# EAGLE design rb1.2 panelized (EAGLE 9.5.2)
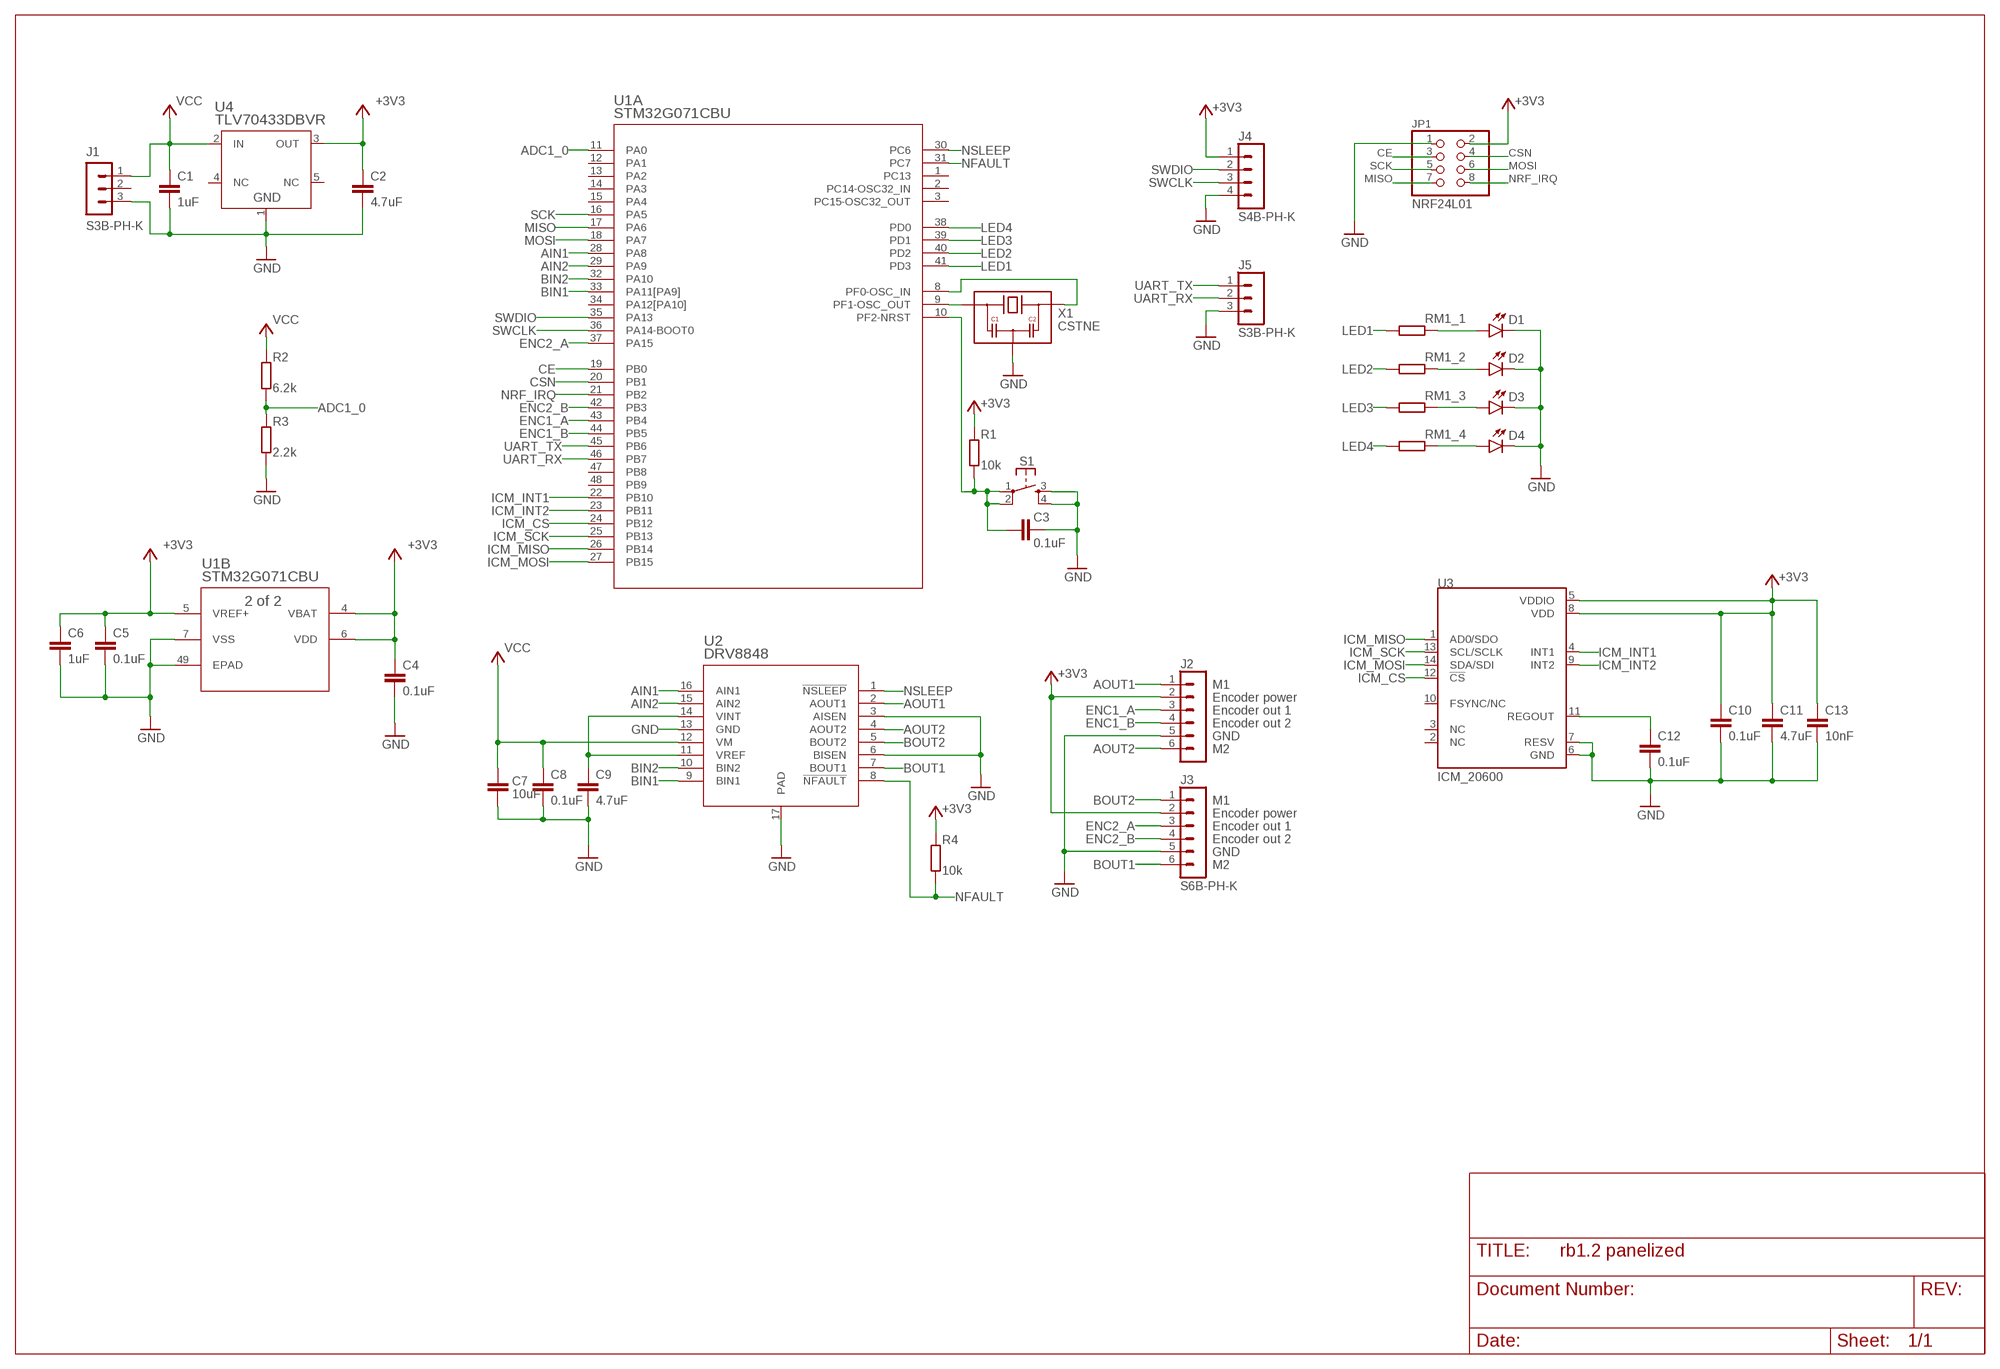
[diagram p0: schematic, sheet 1]

## Parts
C1  1uF  C-EU-K0603  [C0603K]
C2  4.7uF  C-EU-K0603  [C0603K]
C3  0.1uF  C-EU-K0402  [C0402K]
C4  0.1uF  C-EU-K0603  [C0603K]
C5  0.1uF  C-EU-K0603  [C0603K]
C6  1uF  C-EU-K0603  [C0603K]
C7  10uF  C-EU-K1206  [C1206K]
C8  0.1uF  C-EU-K0603  [C0603K]
C9  4.7uF  C-EU-K0603  [C0603K]
C10  0.1uF  C-EU-K0603  [C0603K]
C11  4.7uF  C-EU-K0603  [C0603K]
C12  0.1uF  C-EU-K0603  [C0603K]
C13  10nF  C-EU-K0603  [C0603K]
D1  LED0805  [LED-0805]
D2  LED0805  [LED-0805]
D3  LED0805  [LED-0805]
D4  LED0805  [LED-0805]
J1  S3B-PH-K  [S3B-PH-K]
J2  S6B-PH-K  [S6B-PH-K]
J3  S6B-PH-K  [S6B-PH-K]
J4  S4B-PH-K  [S4B-PH-K]
J5  S3B-PH-K  [S3B-PH-K]
JP1  NRF24L01  PINHD-2X4  [2X04]
R1  10k  R-EU0603  [R0603]
R2  6.2k  R-EU0603  [R0603]
R3  2.2k  R-EU0603  [R0603]
R4  10k  R-EU0603  [R0603]
RM1  RES_ARRAY  [0603-ARC]
S1  MOMENTARY-SWITCH-SPST-2-[SMD-5.2MM]  [TACTILE_SWITCH_SMD_5.2MM]
U1  STM32G071CBU  STM32G0_UFQFPN48  [UFQFPN48-7X7MM]
U2  DRV8848  DRV8848[NORMAL_PADS]  [HTSSOP]
U3  ICM_20600  [14_PIN_LGA]
U4  TLV70433DBVR  TLV70433DBVR[NORMAL_PADS]  [SOT-23-5]
X1  CSTNE  [MURATA_SMD_3P]

## Nets
+3V3: C2.1 C4.1 C5.1 C6.1 C10.1 C11.1 C13.1 J2.2 J3.2 J4.1 JP1.2 R1.2 R4.2 U1.4(B:VBAT) U1.5(B:VREF+) U1.6(B:VDD) U3.5(VDDIO) U3.8(VDD) U4.3(OUT)
ADC1_0: R2.1 R3.2 U1.11(A:PA0)
AIN1: U1.28(A:PA8) U2.16(AIN1)
AIN2: U1.29(A:PA9) U2.15(AIN2)
AOUT1: J2.1 U2.2(AOUT1)
AOUT2: J2.6 U2.4(AOUT2)
BIN1: U1.33(A:PA11[PA9]) U2.9(BIN1)
BIN2: U1.32(A:PA10) U2.10(BIN2)
BOUT1: J3.6 U2.7(BOUT1)
BOUT2: J3.1 U2.5(BOUT2)
CE [NRF24L01]: JP1.3 U1.19(A:PB0)
CSN [NRF24L01]: JP1.4 U1.20(A:PB1)
ENC1_A: J2.3 U1.43(A:PB4)
ENC1_B: J2.4 U1.44(A:PB5)
ENC2_A: J3.3 U1.37(A:PA15)
ENC2_B: J3.4 U1.42(A:PB3)
GND: C1.2 C2.2 C3.1 C4.2 C5.2 C6.2 C7.2 C8.2 C9.2 C10.2 C11.2 C12.2 C13.2 D1.-(C) D2.-(C) D3.-(C) D4.-(C) J1.3 J2.5 J3.5 J4.4 J5.3 JP1.1 R3.1 S1.3 S1.4 U1.7(B:VSS) U1.49(B:EPAD) U2.3(AISEN) U2.6(BISEN) U2.13(GND) U2.17(PAD) U3.6(GND) U3.7(RESV) U4.1(GND) X1.2(GND)
ICM_CS [ICM20600]: U1.24(A:PB12) U3.12(!CS)
ICM_INT1 [ICM20600]: U1.22(A:PB10) U3.4(INT1)
ICM_INT2 [ICM20600]: U1.23(A:PB11) U3.9(INT2)
ICM_MISO [ICM20600]: U1.26(A:PB14) U3.1(AD0/SDO)
ICM_MOSI [ICM20600]: U1.27(A:PB15) U3.14(SDA/SDI)
ICM_SCK [ICM20600]: U1.25(A:PB13) U3.13(SCL/SCLK)
LED1: RM1.1 U1.41(A:PD3)
LED2: RM1.2 U1.40(A:PD2)
LED3: RM1.3 U1.39(A:PD1)
LED4: RM1.4 U1.38(A:PD0)
MISO [NRF24L01]: JP1.7 U1.17(A:PA6)
MOSI [NRF24L01]: JP1.6 U1.18(A:PA7)
N$2: U1.8(A:PF0-OSC_IN) X1.3(OUT)
N$3: U1.9(A:PF1-OSC_OUT) X1.1(IN)
N$4: D4.+(A) RM1.5
N$6: D3.+(A) RM1.6
N$7: D2.+(A) RM1.7
N$8: D1.+(A) RM1.8
NFAULT: R4.1 U1.31(A:PC7) U2.8(!NFAULT)
NRF_IRQ [NRF24L01]: JP1.8 U1.21(A:PB2)
NSLEEP: U1.30(A:PC6) U2.1(!NSLEEP)
REG: C12.1 U3.11(REGOUT)
RESET: C3.2 R1.1 S1.1 S1.2 U1.10(A:PF2-NRST)
SCK [NRF24L01]: JP1.5 U1.16(A:PA5)
SWCLK: J4.3 U1.36(A:PA14-BOOT0)
SWDIO: J4.2 U1.35(A:PA13)
UART_RX: J5.2 U1.46(A:PB7)
UART_TX: J5.1 U1.45(A:PB6)
VCC: C1.1 C7.1 C8.1 J1.1 R2.2 U2.12(VM) U4.2(IN)
VREF: C9.1 U2.11(VREF) U2.14(VINT)
Unconnected: J1.2 U1.1(A:PC13) U1.2(A:PC14-OSC32_IN) U1.3(A:PC15-OSC32_OUT) U1.12(A:PA1) U1.13(A:PA2) U1.14(A:PA3) U1.15(A:PA4) U1.34(A:PA12[PA10]) U1.47(A:PB8) U1.48(A:PB9) U3.2(NC) U3.3(NC) U3.10(FSYNC/NC) U4.4(NC) U4.5(NC)

## Notes on the sheet
- M1
- Encoder power
- Encoder out 1
- Encoder out 2
- GND
- M2
- M1
- Encoder power
- Encoder out 1
- Encoder out 2
- GND
- M2

## Library data of the parts
C1-C13 = Capacitors:C-EU-K
D1-D4 = Semiconductor_devices:LED0805: LED Model suitable for all 0805 leds Updated: 22.10.19 by Andrey Dovnar, andrevdovnar@gmail.com
J1 J5 = con-jst-ph:S3B-PH-K: Wire to board connector Model suitable for S3B-PH-K Updated: 21.10.19 by Andrey Dovnar, andrevdovnar@gmail.com
J2 J3 = con-jst-ph:S6B-PH-K: Wire to board connector Model suitable for S6B-PH-K Updated: 21.10.19 by Andrey Dovnar, andrevdovnar@gmail.com
J4 = con-jst-ph:S4B-PH-K: Wire to board connector Model suitable for S4B-PH-K Updated: 21.10.19 by Andrey Dovnar, andrevdovnar@gmail.com
JP1 = pinhead:PINHD-2X4: PIN HEADER
R1-R4 = Resistors:R-EU
RM1 = Resistors:RES_ARRAY
S1 = buttons and switches:MOMENTARY-SWITCH-SPST-2: Smd buttom Updated: 16.11.19 by Andrey Dovnar, andrevdovnar@gmail.com; PROD_ID: SWCH-08247; SF_SKU: COM-08720
U1 = stmicroelectronics:STM32G0_UFQFPN48: MCU Model suitable for STM32G071CBU3/6 Created: 16.11.19 by Andrey Dovnar, andrevdovnar@gmail.com
U2 = texas Instrumets:DRV8848: Integrated motor driver Model suitable for DRV8848PWP 2 канала по 1 А. Максимальное входное напряжение - 18 В. Поддерживает параллельное включение каналов. Created: 18.10.19 by Andrey Dovnar, andrevdovnar@gmail.com
U3 = InvenSence:ICM_20600: 6-axis IMU Model suitable for ICM-20600 Created: 18.10.19 by Andrey Dovnar, andrevdovnar@gmail.com Updated: 16.11.19 by Andrey Dovnar, andrevdovnar@gmail.com
U4 = texas Instrumets:TLV70433DBVR: LDO Model suitable for TLV70433DBVR Created: 18.10.19 by Andrey Dovnar, andrevdovnar@gmail.com; TEST: da
X1 = resonators and oscillators:CSTNE: Ceramic Resonator with integrated load capacitors No external components required Model suitable for all Murata electronics resonators from CSTNE_G, CSTNE_V, CSTNE_VH3L and CSTNE_GH5L families Created: 16.11.19 by Andrey Dovnar, andrevdovnar@gmail.com

## Board
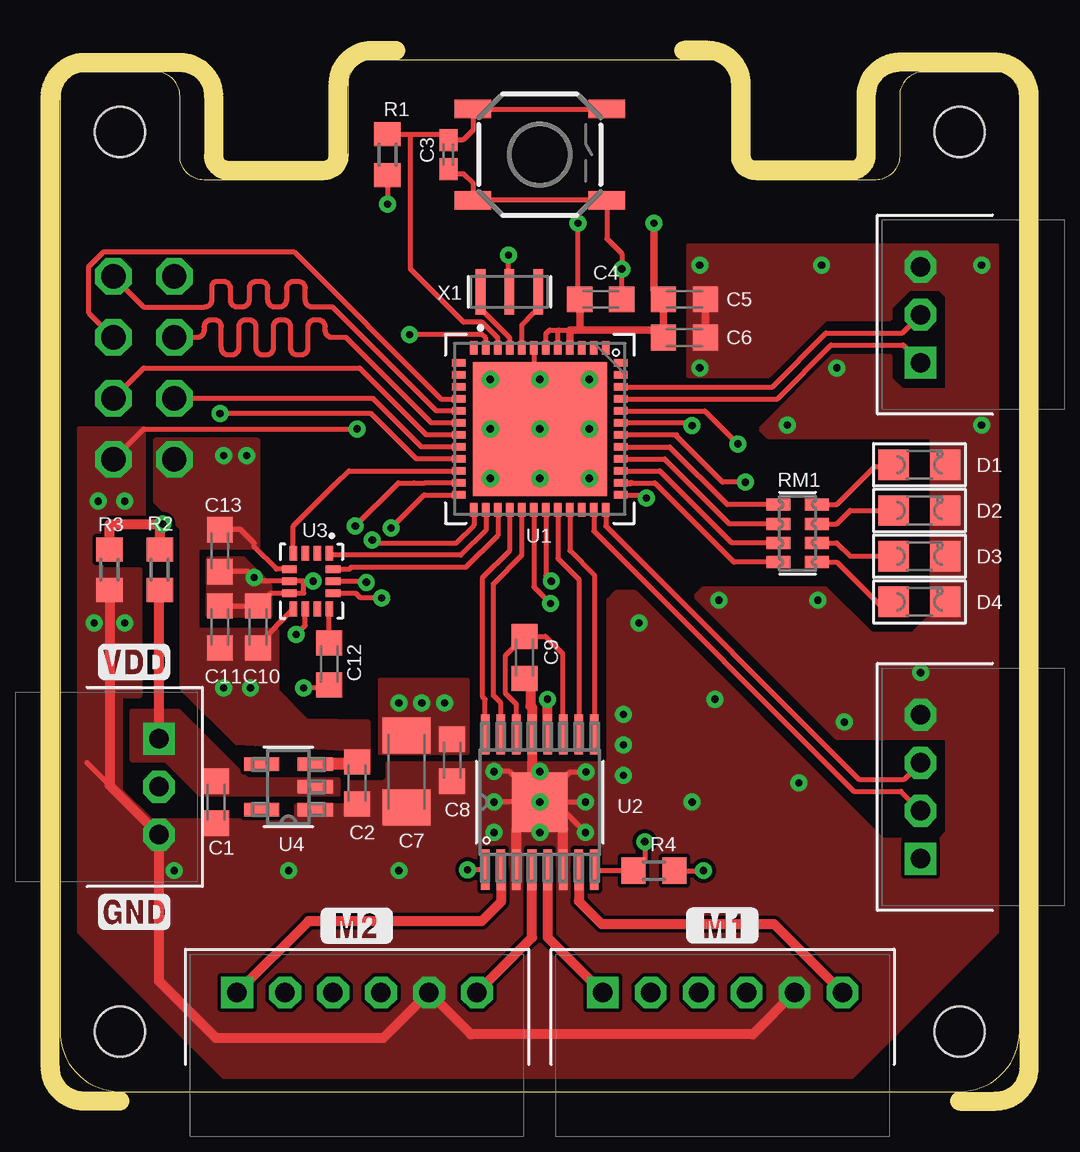
[diagram p1: board, top side]
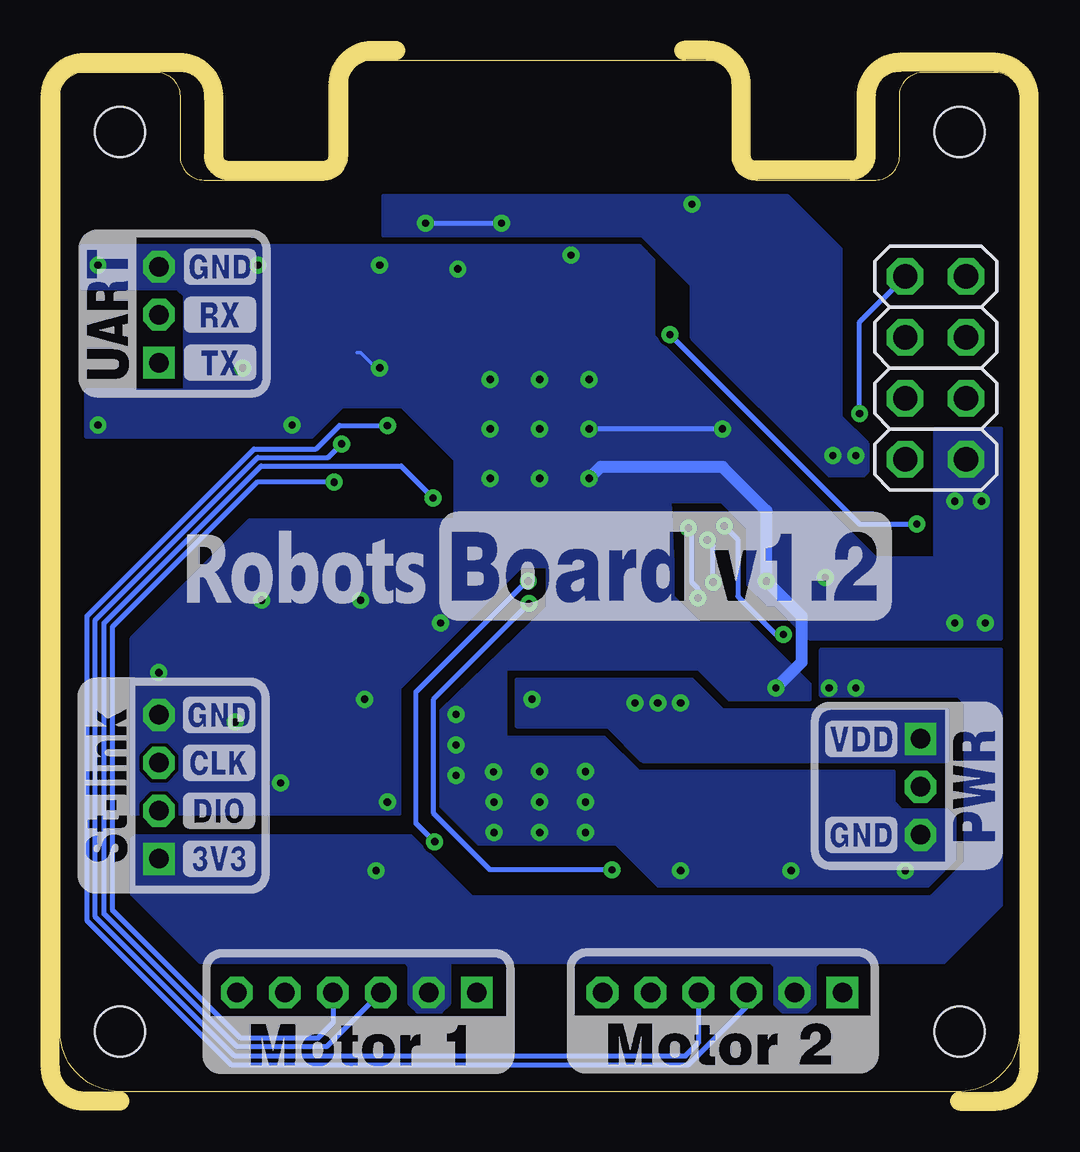
[diagram p2: board, bottom side, seen from below]

Size 40 x 43 mm. Coordinates in mm from the lower left corner, seen from the top.
Outline: 11,38 6,38 arc-90 5,39 5,41.5 arc90 4,42.5 1,42.5 arc90 0,41.4 0,2.5 arc90 2.5,0 37.5,0 arc90 40,2.5 40,41.5 arc90 39,42.5 36,42.5 arc90 35,41.5 35,39 arc-90 34,38 29,38 arc-90 28,39 28,42 arc90 27,43 13,43 arc90 12,42 12,39 arc-90 11,38
Copper layers (1*16): Top 0.035mm / dielectric 1.5mm / Bottom 0.035mm
Design rules "default *": minimum track width 6mil, minimum drill 0.3mm, track to track 6mil, track to pad 6mil, pad to pad 6mil, via to via 6mil, smd to smd 6mil, copper to edge 10mil, drill to drill 6mil, minimum pad ring 10mil, minimum via ring 8mil, stop-mask expansion 4mil, vias tented up to drill 20mil, thermal gap 10mil
Holes 2.1 mm at 37.5,40 2.5,40 2.5,2.5 37.5,2.5
Milling: 26 lines

### Footprints (pad centres in the part's own frame; a part is rotated, then mirrored left to right if it is on the bottom)
C0603K = smd 1.05 x 1.08: 1 -0.875,0; 2 0.875,0
C0402K = smd 0.925 x 0.74: 1 -0.6,0; 2 0.6,0
C1206K = smd 1.5 x 2: 1 -1.5,0; 2 1.5,0
LED-0805 = smd 1.27 x 1.27: + -1.079,0; - 1.079,0
S3B-PH-K = drill 0.813 square: 1 -2,0 | drill 0.813 octagon: 2 0,0; 3 2,0
S6B-PH-K = drill 0.813 square: 1 -5,0 | drill 0.813 octagon: 2 -3,0; 3 -1,0; 4 1,0; 5 3,0; 6 5,0
S4B-PH-K = drill 0.813 square: 1 -3,0 | drill 0.813 octagon: 2 -1,0; 3 1,0; 4 3,0
2X04 = drill 1.016 octagon: 1 -3.81,-1.27; 2 -3.81,1.27; 3 -1.27,-1.27; 4 -1.27,1.27; 5 1.27,-1.27; 6 1.27,1.27; 7 3.81,-1.27; 8 3.81,1.27
R0603 = smd 1 x 1.1: 1 -0.85,0; 2 0.85,0
0603-ARC = smd 0.5 x 1: 1 -1.2,-0.802; 2 -0.4,-0.802; 3 0.4,-0.802; 4 1.2,-0.802; 5 1.2,0.802; 6 0.4,0.802; 7 -0.4,0.802; 8 -1.2,0.802
TACTILE_SWITCH_SMD_5.2MM = smd 1.524 x 0.762: 1 -2.794,1.905; 2 2.794,1.905; 3 -2.794,-1.905; 4 2.794,-1.905
UFQFPN48-7X7MM = smd 0.559 x 0.305: 1 -3.375,2.751; 2 -3.375,2.251; 3 -3.375,1.75; 4 -3.375,1.25; 5 -3.375,0.75; 6 -3.375,0.25; 7 -3.375,-0.25; 8 -3.375,-0.75; 9 -3.375,-1.25; 10 -3.375,-1.75; 11 -3.375,-2.251; 12 -3.375,-2.751; 25 3.375,-2.751; 26 3.375,-2.251; 27 3.375,-1.75; 28 3.375,-1.25; 29 3.375,-0.75; 30 3.375,-0.25; 31 3.375,0.25; 32 3.375,0.75; 33 3.375,1.25; 34 3.375,1.75; 35 3.375,2.251; 36 3.375,2.751 | smd 0.305 x 0.559: 13 -2.751,-3.375; 14 -2.251,-3.375; 15 -1.75,-3.375; 16 -1.25,-3.375; 17 -0.75,-3.375; 18 -0.25,-3.375; 19 0.25,-3.375; 20 0.75,-3.375; 21 1.25,-3.375; 22 1.75,-3.375; 23 2.251,-3.375; 24 2.751,-3.375; 37 2.751,3.375; 38 2.251,3.375; 39 1.75,3.375; 40 1.25,3.375; 41 0.75,3.375; 42 0.25,3.375; 43 -0.25,3.375; 44 -0.75,3.375; 45 -1.25,3.375; 46 -1.75,3.375; 47 -2.251,3.375; 48 -2.751,3.375 | smd 5.588 x 5.588: 49 0,0
HTSSOP = smd 1.676 x 0.356: 1 -2.819,2.275; 2 -2.819,1.625; 3 -2.819,0.975; 4 -2.819,0.325; 5 -2.819,-0.325; 6 -2.819,-0.975; 7 -2.819,-1.625; 8 -2.819,-2.275; 9 2.819,-2.275; 10 2.819,-1.625; 11 2.819,-0.975; 12 2.819,-0.325; 13 2.819,0.325; 14 2.819,0.975; 15 2.819,1.625; 16 2.819,2.275 | smd 2.464 x 2.311: 17 0,0
14_PIN_LGA = smd 0.61 x 0.3: 1 -1.16,0.75; 2 -1.16,0.25; 3 -1.16,-0.25; 4 -1.16,-0.75; 8 1.16,-0.75; 9 1.16,-0.25; 10 1.16,0.25; 11 1.16,0.75 | smd 0.3 x 0.61: 5 -0.5,-0.91; 6 0,-0.91; 7 0.5,-0.91; 12 0.5,0.91; 13 0,0.91; 14 -0.5,0.91
SOT-23-5 = smd 1.473 x 0.559: 1 -1.118,0.95; 2 -1.118,0; 3 -1.118,-0.95; 4 1.118,-0.95; 5 1.118,0.95
MURATA_SMD_3P = smd 0.4 x 1.9: 1 -1.2,0; 2 0,0; 3 1.2,0

### Placement (x,y rotation side)
C1  6.51,12.06 270 top
C2  12.38,12.86 270 top
C3  16.19,39.05 90 top
C4  22.54,33.02 0 top
C5  26.04,33.02 0 top
C6  26.04,31.43 0 top
C7  14.45,13.34 270 top
C8  16.35,13.81 270 top
C9  19.37,18.1 270 top
C10  8.26,19.37 90 top
C11  6.67,19.37 90 top
C12  11.23,17.82 270 top
C13  6.67,22.54 270 top
D1  35.83,26.12 0 top
D2  35.83,24.22 0 top
D3  35.83,22.31 0 top
D4  35.83,20.41 0 top
J1  4.13,12.7 270 top
J2  12.38,4.13 0 top
J3  27.62,4.13 0 top
J4  35.88,12.7 90 top
J5  35.88,32.38 90 top
JP1  3.49,30.16 90 bottom
R1  13.65,39.05 270 top
R2  4.16,21.75 270 top
R3  2.06,21.75 90 top
R4  24.77,9.21 0 top
RM1  30.75,23.27 270 top
S1  20,39.05 0 top
U1  20,27.62 270 top
U2  20,12.06 90 top
U3  10.48,21.27 270 top
U4  9.53,12.7 180 top
X1  18.73,33.34 0 top

### Tracks (layer width: path | path; a pad name or v marks a point on that pad's centre or on a via)
+3V3  (via drill 0.3, 0.3 pad 0.3)
  Top 0.203: U3.8 8.26,18.64 C10.1 | U3.5 9.03,21.77 8.1,22.7 8.1,22.86 7.54,23.42 C13.1 | C4.1 21.59,33.1 v21.59,36.2 | R1.2 v13.65,36.99 | R4.2 v26.83,9.21 | U1.5 20.75,31.71 20.8,31.75 | 20.8,31.75 21.27,31.75 | U1.6 20.25,31.59 20.41,31.75 20.8,31.75
  Top 0.305: 21.67,31.75 24.77,31.75 25.16,31.36 C6.1 C5.1 24.77,33.41 v24.77,36.2 | 21.67,31.75 21.27,31.75 21.25,31.73 U1.4 | C4.1 21.67,31.75
  Top 0.508: C2.1 12.3,13.65 U4.3
  Bottom 0.203: v24.77,36.2 v21.59,36.2
  other vias: 7.78,26.51 7.94,16.83 6.83,16.83 6.83,26.51
  pour Top (no thermals): 7.36,14.54 12.22,14.29 12.22,13.34 12.86,13.34 12.86,15.4 10.27,15.45 9.05,16.67 9.05,19.21 5.72,19.21 5.72,22.7 8.26,22.7 8.26,27.15 3.97,27.15 3.97,24.61 5.08,23.5 5.08,16.83
  pour Bottom (no thermals): 26.51,35.72 15.72,35.72 13.65,33.66 13.65,31.43 7.94,25.72 6.51,25.72 6.35,25.88 6.35,26.99 7.46,28.1 7.46,35.08 9.68,37.31 26.51,37.31
  pour Bottom (no thermals): 36.83,10.64 25.4,10.64 22.86,8.1 3.65,8.1 2.22,9.53 2.22,16.19 2.54,16.51 8.26,16.51 8.26,18.41 0.79,18.41 0.79,7.78 3.18,5.4 8.41,5.4 8.57,5.24 8.57,3.65 8.89,3.33 9.84,3.33 10.16,3.65 10.16,5.24 10.32,5.4 23.81,5.4 23.81,3.65 24.13,3.33 25.08,3.33 25.4,3.65 25.4,5.24 25.56,5.4 34.13,5.4 36.99,8.26 36.99,10.48
ADC1_0  (via drill 0.3)
  Top 0.203: U1.11 17.75,31.4 | 17.75,31.4 17.75,31.41 | 17.75,31.4 17.6,31.55 v14.57,31.55
  Top 0.406: R3.2 2.06,23.65 v4.29,23.65 4.16,23.53 R2.1
  Bottom 0.203: v14.57,31.55 6.67,23.65 v4.29,23.65
AIN1
  Top 0.2: 18.75,22.56 17.62,21.43 17.62,16.45 17.73,16.35 U2.16
  Top 0.203: 18.75,22.56 U1.28
AIN2
  Top 0.2: 19.25,22.36 18.06,21.16 18.06,16.51 18.38,16.2 U2.15
  Top 0.203: 19.25,22.36 U1.29
AOUT1
  Top 0.406: U2.2 18.38,7.9 17.58,7.1 10.36,7.1 J2.1
AOUT2
  Top 0.406: J2.6 19.68,6.42 U2.4
BIN1
  Top 0.2: 21.25,22.54 22.28,21.52 U2.9
  Top 0.203: U1.33 21.25,22.54
BIN2
  Top 0.2: 20.75,22.23 21.63,21.35 U2.10
  Top 0.203: U1.32 20.75,22.23
BOUT1
  Top 0.406: U2.7 21.63,7.94 22.58,6.99 29.77,6.99 J3.6
BOUT2
  Top 0.406: U2.5 20.33,6.42 J3.1
CE
  Top 0.203: U1.19 15.27,27.37 12.48,30.16 3.49,30.16 JP1.3
CSN
  Top 0.203: U1.20 15.07,26.87 13.05,28.89 9.68,28.89 JP1.4
ENC1_A  (via drill 0.3)
  Top 0.203: v26.35,27.77 26.25,27.87 23.65,27.87 | U1.43 23.65,27.87 | 23.65,27.87
  Bottom 0.203: J2.3 11.38,3.53 13.8,1.12 32.87,1.12 38.88,7.13 38.88,19.81 31.91,26.78 29.33,26.78 28.35,27.77 v26.35,27.77
ENC1_B  (via drill 0.3)
  Top 0.203: v28.26,27 26.88,28.37 U1.44
  Bottom 0.203: J2.4 13.38,2.04 13.95,1.47 32.7,1.47 32.74,1.51 32.76,1.51 38.53,7.28 38.53,19.66 31.76,26.43 28.83,26.43 v28.26,27
ENC2_A  (via drill 0.3)
  Top 0.203: v24.45,24.74 24.32,24.87 U1.37
  Bottom 0.203: v24.45,24.74 25.78,26.07 31.61,26.07 38.17,19.52 38.17,7.43 32.61,1.87 28.88,1.87 J3.3
ENC2_B  (via drill 0.3)
  Top 0.203: U1.42 25.72,27.37 25.72,27.3 27.62,25.4 v28.58,25.4
  Bottom 0.203: J3.4 28.62,2.86 29.26,2.22 32.46,2.22 37.82,7.57 37.82,19.37 31.78,25.4 v28.58,25.4
GND  (via drill 0.3, 0.3 pad 0.3)
  Top 0.2: U3.6 8.57,21.27 | 10.16,21.27 v10.55,21.27 | C11.2 C10.2 8.79,20.77 U3.7 | C12.2 11.11,16.83 v10.16,16.83 | 19.68,15.08 U2.13
  Top 0.203: X1.2 18.69,33.38 v18.69,34.86 | C3.1 16.19,38.16 | C3.1 16.16,38.42 | U3.7 10.16,20.77 10.16,20.78 10.16,21.27 U3.6 | C4.2 v23.42,34.29 23.42,34.92 22.8,35.55 S1.4 S1.3 17.21,37.88 16.83,38.26 16.39,38.26 C3.1 | 8.57,21.27 8.26,21.27 7.86,21.67 C13.2 | JP1.1 3.49,27.62 v12.38,27.62 | U1.49 19.13,28.5 | v17.94,29.69 18.1,29.69 19.21,28.57 19.75,29.12 U1.7 | U1.49 v20,29.69 | U1.49 v22.07,29.69 | U1.49 v17.94,27.62 | U1.49 v22.07,27.62 | U1.49 v17.94,25.56 | U1.49 v20,25.56 | U1.49 v22.07,25.56 | 2.25,12.57 1.12,13.71 | v20,10.79 20,11.91 U2.17 | U1.49 19.05,26.67 17.94,26.67 | U2.17 18.73,13.34 v18.1,13.34 | U2.17 v20,13.34 | U2.17 21.26,13.32 v21.92,13.32 | U2.17 v21.91,12.06 | U2.17 19.37,12.06 v18.1,12.06 | U2.17 20.64,12.06 v21.91,10.79
  Top 0.305: C6.2 C5.2
  Top 0.406: 19.68,12.07 19.84,11.91 U2.17 | R3.1 2.06,12.76 2.25,12.57 J1.3 4.13,4.6 6.51,2.22 13.48,2.22 J2.5 17.13,2.38 28.88,2.38 J3.5 | 19.68,15.08 19.68,15.99 19.61,16.06 19.61,16.98 C9.2 | U2.3 19.03,10.93 20,11.91 20.98,10.93 U2.6 | U2.13 19.68,12.38 19.37,12.06
  Bottom 0.152: 26.99,30.32 27.46,30.8 27.62,30.8
  Bottom 0.203: v12.38,27.62 v17.94,27.62
  Bottom 0.508: v17.94,25.56 17.46,26.04 12.38,26.04 10.55,24.2 v10.55,21.27 9.08,19.8 9.08,17.91 v10.16,16.83
  other vias: 24.13,19.53 27.31,16.35 30.8,12.86 35.88,17.46 20,27.62 18.1,10.79 20,12.06 31.75,34.45 27.46,20.48 31.59,20.48 8.1,21.43 1.59,24.61 2.7,24.61 23.5,15.72 23.5,14.45 23.5,13.18 1.43,19.53 2.7,19.53 26.67,34.45 26.67,30.16 30.32,27.78 4.76,9.21 9.53,9.21 14.13,9.21 38.42,27.78 38.42,34.45 32.7,15.4 26.35,12.06 32.39,30.16
  pour Bottom (no thermals): 15.88,35.24 15.29,34.66 15.29,31.49 6.03,22.23 3.49,22.23 3.49,27.62 0.79,27.62 0.79,18.89 8.73,18.89 10.16,20.32 10.48,20.32 11.27,21.11 11.27,23.5 12.38,24.61 14.61,24.61 14.5,21.91 20.8,21.91 25.88,16.83 25.88,11.59 36.99,11.59 36.99,18.89 32.07,23.81 23.5,23.81 23.5,26.35 25.72,28.57 28.26,28.57 29.53,27.3 38.89,27.3 38.89,29.21 34.77,29.21 34.77,33.18 35.08,33.5 39.05,33.5 39.05,35.24
  pour Top (no thermals): 6.19,22.23 7.62,22.23 8.73,21.11 8.73,19.84 6.19,19.84
  pour Top (no thermals): 26.19,35.24 26.19,29.84 29.53,29.84 31.91,32.23 34.61,32.23 34.61,32.7 35.4,33.5 36.67,33.5 36.99,33.18 36.99,29.21 35.08,29.21 34.61,29.69 34.61,30.64 32.23,30.64 29.21,27.62 29.53,27.3 36.35,27.3 36.35,19.84 35.56,19.05 33.81,19.05 31.91,20.95 26.83,20.95 26.51,20.64 32.39,14.76 36.99,14.76 36.99,10.79 36.67,10.48 34.29,10.48 23.97,20.8 23.18,20.8 22.86,20.48 22.86,13.65 13.65,13.65 13.65,13.02 13.49,12.86 12.07,12.86 12.07,11.91 9.84,11.91 9.84,11.27 3.81,11.27 2.54,12.54 2.54,16.51 3.33,16.51 3.33,21.75 1.75,21.75 1.75,23.5 3.49,23.5 3.49,27.62 0.79,27.62 0.79,6.67 6.83,0.64 33.02,0.64 39.05,6.67 39.05,35.24
  pour Bottom (no thermals): 17.3,14.76 21.43,14.76 21.43,17.62 13.39,17.62 12.12,16.35 8.73,16.35 8.73,16.99 11.27,19.53 13.34,19.53 14.45,20.64 14.45,22.23 19.69,22.23 19.69,20.18 24.13,15.88 24.13,11.91 22.54,10.32 16.83,10.32 15.08,8.57 3.81,8.57 2.7,9.68 2.7,11.43 3.02,11.75 4.92,11.75 5.24,12.06 5.24,13.34 15.88,13.34
ICM_CS  (via drill 0.3 pad 0.3)
  Top 0.203: U3.12 12.33,20.77 12.51,20.59 13.38,20.59 v13.4,20.57 | v13.8,23.49 15.18,24.87 U1.24
  Bottom 0.203: v13.4,20.57 13.4,20.96 13.65,21.21 13.65,23.34 v13.8,23.49
ICM_INT1
  Top 0.203: U3.4 9.73,23.57 11.5,25.33 12.03,25.87 U1.22
ICM_INT2  (via drill 0.3 pad 0.3)
  Top 0.2: 14.75,25.37 15.21,25.37 | v9.84,19.05 10.23,19.43 U3.9
  Top 0.203: U1.23 15.21,25.37 | v12.31,23.57 14.11,25.37 14.75,25.37
  Bottom 0.2: v12.31,23.57 11.83,23.09 11.75,23.01 11.75,20.64 10.16,19.05 v9.84,19.05
ICM_MISO
  Top 0.203: U1.26 17.75,23.39 16.72,22.36 11.3,22.36 U3.1
ICM_MOSI
  Top 0.203: U3.14 12.07,21.77 12.15,21.86 16.92,21.86 18.25,23.19 U1.27
ICM_SCK  (via drill 0.3 pad 0.3)
  Top 0.203: U1.25 17.25,23.6 16.51,22.86 13.15,22.86 v13.02,22.99 | U3.13 12.73,21.27 v12.77,21.23
  Bottom 0.203: v12.77,21.23 12.77,22.75 v13.02,22.99
LED1
  Top 0.2: U1.41 25.42,26.87 27.82,24.47 RM1.1
LED2
  Top 0.2: U1.40 25.21,26.37 27.91,23.67 RM1.2
LED3
  Top 0.2: U1.39 25,25.87 27.98,22.9
  Top 0.203: RM1.3 28.01,22.87 27.98,22.9
LED4
  Top 0.2: U1.38 24.79,25.37 28.1,22.07 RM1.4
  Top 0.254: U1.38 23.81,25.37
MISO
  Top 0.203: U1.17 15.69,28.37 11.36,32.7 10.52,32.7 arc-90 10.23,32.99 10.23,33.47 arc90 9.94,33.77 9.74,33.77 arc90 9.45,33.47 9.45,32.99 arc-90 9.15,32.7 8.96,32.7 arc-90 8.67,32.99 8.67,33.47 arc90 8.37,33.77 8.18,33.77 arc90 7.89,33.47 7.89,32.99 arc-90 7.59,32.7 7.4,32.7 arc-90 7.11,32.99 7.11,33.47 arc90 6.81,33.77 6.54,33.77 arc90 6.33,33.55 6.33,32.99 arc-90 6.03,32.7 3.49,32.7 JP1.7
MOSI
  Top 0.203: U1.18 15.48,27.87 11.92,31.43 11.35,31.43 arc-90 11.05,31.73 11.05,31.87 arc90 10.76,32.17 10.63,32.17 arc90 10.33,31.87 10.33,30.99 arc-90 10.04,30.7 9.9,30.7 arc-90 9.61,30.99 9.61,31.87 arc90 9.32,32.17 9.18,32.17 arc90 8.89,31.87 8.89,30.99 arc-90 8.6,30.7 8.46,30.7 arc-90 8.17,30.99 8.17,31.87 arc90 7.88,32.17 7.74,32.17 arc90 7.45,31.87 7.45,30.99 arc-90 7.16,30.7 7.02,30.7 arc-90 6.73,30.99 6.73,31.87 arc90 6.44,32.17 6.3,32.17 arc90 6.01,31.87 6.01,31.73 arc-90 5.72,31.43 JP1.6
N$2
  Top 0.203: U1.8 19.25,31.95 19.76,32.46 19.93,32.63 X1.3
N$3
  Top 0.203: U1.9 18.75,31.41 17.53,32.63 X1.1
N$4
  Top 0.2: RM1.5 32.39,22.07 34.13,20.32 34.66,20.32 D4.+
  Top 0.254: D4.+ 34.5,20.16
N$6
  Top 0.2: RM1.6 32.39,22.87 32.94,22.31 D3.+
N$7
  Top 0.2: RM1.7 32.39,23.67 32.94,24.22 D2.+
N$8
  Top 0.2: RM1.8 32.39,24.47 33.95,26.04 34.66,26.04 D1.+
  Top 0.203: 34.63,26.01 D1.+
NFAULT  (via drill 0.3)
  Top 0.203: U2.8 22.32,9.21 R4.1 24.39,9.68 v24.39,10.4 v24.38,10.41 | v20.48,21.27 20.25,21.5 U1.31
  Bottom 0.203: v24.38,10.41 25.17,11.21 25.17,16.63 20.53,21.27 v20.48,21.27
NRF_IRQ  (via drill 0.3)
  Top 0.203: U1.21 14.86,26.37 12.97,28.26 v6.67,28.26
  Bottom 0.203: v6.67,28.26 6.67,32.07 JP1.8
NSLEEP  (via drill 0.3, 0.3 pad 0.3)
  Top 0.203: U2.1 v16.99,9.25 | v20.44,20.34 19.75,21.03 U1.30
  Bottom 0.203: v16.99,9.25 22.07,9.25 24.45,11.62 24.45,16.34 v20.44,20.34
REG
  Top 0.2: C12.1 U3.11
RESET
  Top 0.203: 18.25,31.11 U1.10 18.25,31.41 17.6,32.07 16.83,32.07 14.61,34.29 14.61,39.9 | R1.1 14.61,39.9 | 14.61,39.9 15.94,39.9 C3.2 16.23,39.69 16.83,39.69 17.21,40.07 S1.1 S1.2
SCK
  Top 0.203: U1.16 15.9,28.87 9.76,35.01 1.82,35.01 1.21,34.39 1.21,32.45 JP1.5
SWCLK
  Top 0.2: U1.36 22.75,23.57 33.3,13.02 35.2,13.02 J4.3
SWDIO
  Top 0.2: U1.35 22.25,23.36 33.1,12.52 35.06,12.52 J4.2
UART_RX
  Top 0.203: U1.46 29.69,29.37 31.93,31.61 35.11,31.61 J5.2
UART_TX
  Top 0.203: U1.45 29.9,28.87 32.14,31.11 35.15,31.11 J5.1
VCC  (via drill 0.3)
  Top 0.406: J1.1 4.13,20.87 R2.2 | U2.12 v20.33,16.34 v20.32,16.35
  other vias: 14.13,16.19 15.08,16.19 16.03,16.19
  pour Bottom (no thermals): 3.02,15.88 12.38,15.88 13.65,17.14 20.96,17.14 20.96,15.24 17.15,15.24 15.72,13.81 3.02,13.81
  pour Top (no thermals): 13.34,17.14 13.34,14.13 16.99,14.13 16.99,17.14
  pour Top (no thermals): 11.59,13.02 11.59,12.38 5.87,12.38 4.45,13.81 3.02,13.81 3.02,15.88 4.92,15.88 7.78,13.02
VREF
  Top 0.2: 20.96,17.78 20.96,18.26 20.24,18.97 C9.1 18.58,18.18 18.58,16.59 19.03,16.14 U2.14
  Top 0.203: U2.11 20.96,14.91 20.96,17.78

### Text on the board
Document: R1 | C3 | S1 | X1 | C4 | C5 | J5 | C6 | JP1 | U1 | D1 | D2 | C13 | RM1 | R3 | R2 | D3 | U3 | D4 | C11 | C10 | C12 | C9 | C8 | J1 | U4 | C2 | C7 | J4 | C1 | U2 | R4 | J2 | J3
_tPlace: S1
_tNames: R1 | C3 | C4 | X1 | C5 | C6 | RM1 | D1 | R3 | R2 | C13 | D2 | U3 | U1 | D3 | D4 | C9 | C11 | C10 | C12 | C8 | U2 | C2 | C1 | U4 | C7 | R4